# EAGLE board Pinscape Pico - Pro (SMD) Expansion Board (EAGLE 7.7.0), part 1 of 2
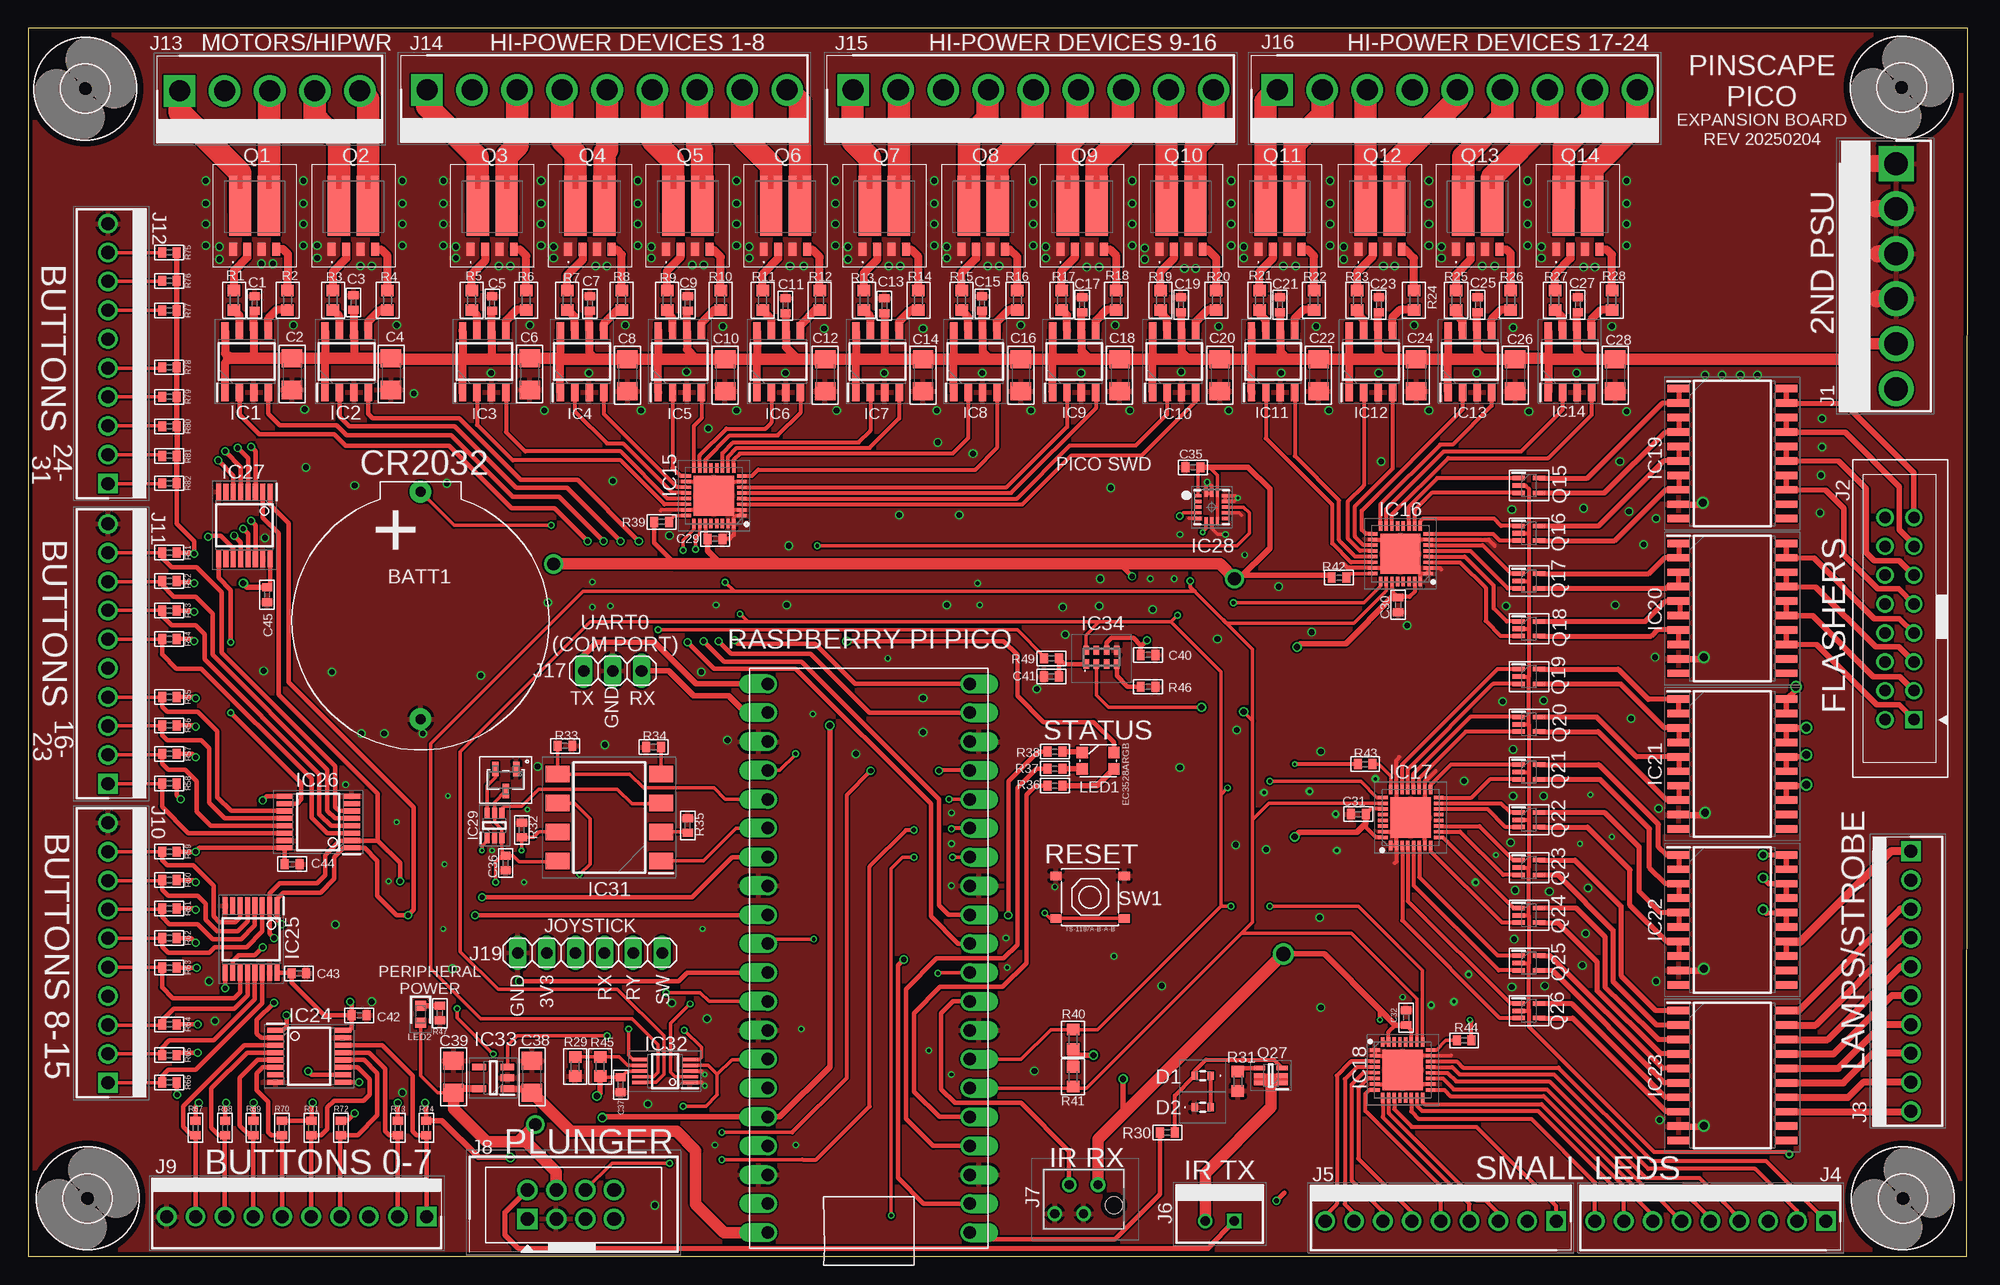
[diagram p12: board, top side]
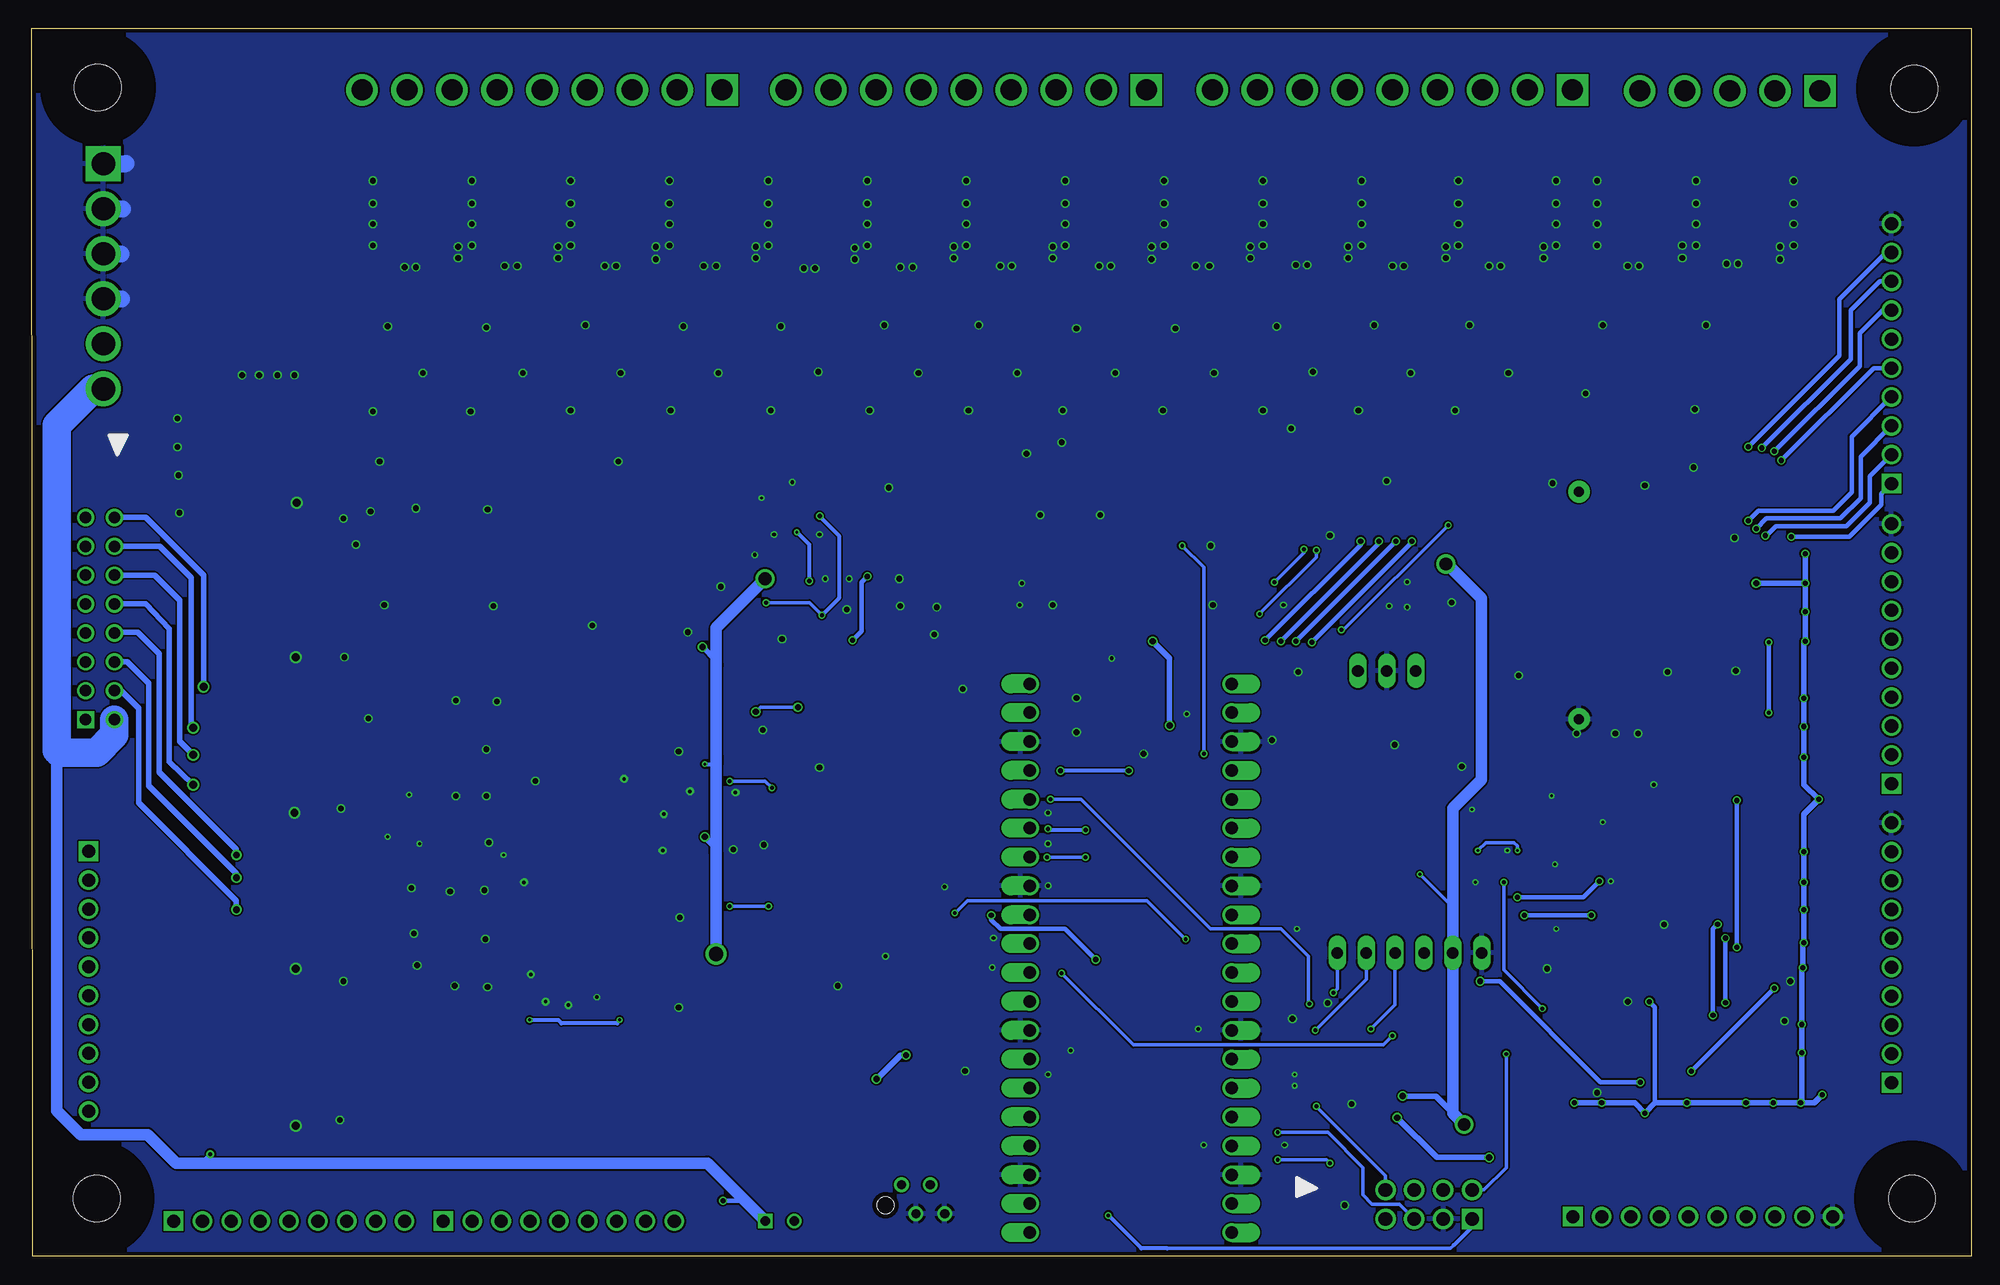
[diagram p13: board, bottom side, seen from below]

Size 170.6 x 108 mm. Coordinates in mm from the lower left corner, seen from the top.
Outline: 0,0 170.5,0 170.6,108 0,108 0,0
Copper layers (1*16): Top 0.035559375mm / dielectric 1.6mm / Bottom 0.035559375mm
Design rules "oshpark-2layer": minimum track width 6mil, minimum drill 10mil, track to track 6mil, track to pad 6mil, pad to pad 6mil, via to via 6mil, smd to smd 6mil, copper to edge 15mil, drill to drill 6mil, minimum pad ring 5mil, minimum via ring 5mil, stop-mask expansion 2.5mil, vias tented up to drill 0mil, thermal gap 10mil
Net classes: 4 5V & GND: width 0.457 mm

## Footprints (pad centres in the part's own frame; a part is rotated, then mirrored left to right if it is on the bottom)
BH-123A-1 = drill 0.9 pad 1.9: + 11.45,0; - -8.55,0
C0402 = smd 0.7 x 0.9: 1 -0.65,0; 2 0.65,0
C1206 = smd 1.6 x 1.8: 1 -1.4,0; 2 1.4,0
1N4148WT7 = smd 0.6 x 0.7: 1 -0.7,0; 2 0.7,0
SOIC127P600X175-8N = smd 1.525 x 0.65: 1 -2.712,1.905; 2 -2.712,0.635; 3 -2.712,-0.635; 4 -2.712,-1.905; 5 2.712,-1.905; 6 2.712,-0.635; 7 2.712,0.635; 8 2.712,1.905
QFN50P500X500X100-33N = smd 0.85 x 0.3: 1 -2.45,1.75; 2 -2.45,1.25; 3 -2.45,0.75; 4 -2.45,0.25; 5 -2.45,-0.25; 6 -2.45,-0.75; 7 -2.45,-1.25; 8 -2.45,-1.75; 17 2.45,-1.75; 18 2.45,-1.25; 19 2.45,-0.75; 20 2.45,-0.25; 21 2.45,0.25; 22 2.45,0.75; 23 2.45,1.25; 24 2.45,1.75 | smd 0.3 x 0.85: 9 -1.75,-2.45; 10 -1.25,-2.45; 11 -0.75,-2.45; 12 -0.25,-2.45; 13 0.25,-2.45; 14 0.75,-2.45; 15 1.25,-2.45; 16 1.75,-2.45; 25 1.75,2.45; 26 1.25,2.45; 27 0.75,2.45; 28 0.25,2.45; 29 -0.25,2.45; 30 -0.75,2.45; 31 -1.25,2.45; 32 -1.75,2.45 | smd 3.55 x 3.55: 33 0,0
SOIC127P1030X265-20N = smd 1.95 x 0.65: 1 -4.725,5.715; 2 -4.725,4.445; 3 -4.725,3.175; 4 -4.725,1.905; 5 -4.725,0.635; 6 -4.725,-0.635; 7 -4.725,-1.905; 8 -4.725,-3.175; 9 -4.725,-4.445; 10 -4.725,-5.715; 11 4.725,-5.715; 12 4.725,-4.445; 13 4.725,-3.175; 14 4.725,-1.905; 15 4.725,-0.635; 16 4.725,0.635; 17 4.725,1.905; 18 4.725,3.175; 19 4.725,4.445; 20 4.725,5.715
SOP65P640X120-16N = smd 1.475 x 0.45: 1 -2.938,2.275; 2 -2.938,1.625; 3 -2.938,0.975; 4 -2.938,0.325; 5 -2.938,-0.325; 6 -2.938,-0.975; 7 -2.938,-1.625; 8 -2.938,-2.275; 9 2.938,-2.275; 10 2.938,-1.625; 11 2.938,-0.975; 12 2.938,-0.325; 13 2.938,0.325; 14 2.938,0.975; 15 2.938,1.625; 16 2.938,2.275
LIS3DHTR = smd 0.6 x 0.3: 1 -1.2,1; 2 -1.2,0.5; 3 -1.2,0; 4 -1.2,-0.5; 5 -1.2,-1; 9 1.2,-1; 10 1.2,-0.5; 11 1.2,0; 12 1.2,0.5; 13 1.2,1 | smd 0.3 x 0.6: 6 -0.5,-1.2; 7 0,-1.2; 8 0.5,-1.2; 14 0.5,1.2; 15 0,1.2; 16 -0.5,1.2
SOP65P210X110-6N = smd 0.95 x 0.45: 1 -1.1,0.65; 2 -1.1,0; 3 -1.1,-0.65; 4 1.1,-0.65; 5 1.1,0; 6 1.1,0.65
SOT23_DIO = smd 0.559 x 1.27: 1 -0.915,-0.965; 2 0.915,-0.965; 3 0,0.965
SOP254P1016X460-8N = smd 2.1 x 1.45: 1 -4.55,3.81; 2 -4.55,1.27; 3 -4.55,-1.27; 4 -4.55,-3.81; 5 4.55,-3.81; 6 4.55,-1.27; 7 4.55,1.27; 8 4.55,3.81
SOP50P490X110-10N = smd 1.4 x 0.3: 1 -2.2,1; 2 -2.2,0.5; 3 -2.2,0; 4 -2.2,-0.5; 5 -2.2,-1; 6 2.2,-1; 7 2.2,-0.5; 8 2.2,0; 9 2.2,0.5; 10 2.2,1
SOT95P280X145-5N = smd 1.2 x 0.6: 1 -1.25,0.95; 2 -1.25,0; 3 -1.25,-0.95; 4 1.25,-0.95; 5 1.25,0.95
RV3032C7 = smd 0.5 x 0.8: 1 -1.35,-0.6; 2 -0.45,-0.6; 3 0.45,-0.6; 4 1.35,-0.6; 5 1.35,0.6; 6 0.45,0.6; 7 -0.45,0.6; 8 -1.35,0.6
SHDR6W183P0X396_1X6_2377X762X1 = drill 2.05 pad 3.075 square: 1 0,0 | drill 2.05 pad 3.075: 2 3.96,0; 3 7.92,0; 4 11.88,0; 5 15.84,0; 6 19.8,0
3M-30316-6002HB = drill 1.01 pad 1.51 square: 1 -8.89,-1.27 | drill 1.01 pad 1.51: 2 -8.89,1.27; 3 -6.35,-1.27; 4 -6.35,1.27; 5 -3.81,-1.27; 6 -3.81,1.27; 7 -1.27,-1.27; 8 -1.27,1.27; 9 1.27,-1.27; 10 1.27,1.27; 11 3.81,-1.27; 12 3.81,1.27; 13 6.35,-1.27; 14 6.35,1.27; 15 8.89,-1.27; 16 8.89,1.27
SHDR10W66P0X254_1X10_2540X572X = drill 1.15 pad 1.725 square: 1 11.43,0 | drill 1.15 pad 1.725: 2 8.89,0; 3 6.35,0; 4 3.81,0; 5 1.27,0; 6 -1.27,0; 7 -3.81,0; 8 -6.35,0; 9 -8.89,0; 10 -11.43,0
SHDR9W66P0X254_1X9_2286X572X10 = drill 1.15 pad 1.725 square: 1 10.16,0 | drill 1.15 pad 1.725: 2 7.62,0; 3 5.08,0; 4 2.54,0; 5 0,0; 6 -2.54,0; 7 -5.08,0; 8 -7.62,0; 9 -10.16,0
HDRV2W66P0X254_1X2_762X572X100 = drill 0.85 pad 1.275 square: 1 1.27,0 | drill 0.85 pad 1.275: 2 -1.27,0
2150794 = drill 0.8 pad 1.3: 1 0,0; 2 -1.27,-2.54; 3 -2.54,0; 4 -3.81,-2.54 | hole 1.5: 1.4,-1.8
SHDR8W69P254_2X4_1780X878X955P = drill 1.2 pad 1.8 square: 1 0,0 | drill 1.2 pad 1.8: 2 0,2.54; 3 2.54,0; 4 2.54,2.54; 5 5.08,0; 6 5.08,2.54; 7 7.62,0; 8 7.62,2.54
HDRV5W117P0X396_1X5_1981X762X1 = drill 1.85 pad 2.775 square: 1 7.92,0 | drill 1.85 pad 2.775: 2 3.958,0; 3 -0.004,0; 4 -3.966,0; 5 -7.928,0
SHDR9W117P0X396_1X9_3566X762X1 = drill 1.85 pad 2.775 square: 1 15.84,0 | drill 1.85 pad 2.775: 2 11.878,0; 3 7.916,0; 4 3.954,0; 5 -0.008,0; 6 -3.97,0; 7 -7.932,0; 8 -11.894,0; 9 -15.856,0
1X03 = drill 1.016 long: 1 -2.54,0; 2 0,0; 3 2.54,0
1X06 = drill 1.016 long: 1 -6.35,0; 2 -3.81,0; 3 -1.27,0; 4 1.27,0; 5 3.81,0; 6 6.35,0
EC3528ARGB = smd 1 x 1: 1 -0.725,1.4; 2 0.725,1.4; 3 -0.725,-1.4; 4 0.725,-1.4
LEDC1608X40N = smd 0.9 x 0.95: 1 -0.75,0; 2 0.75,0
RPI_PICO_TH_NO_DEBUG = drill 1.1 pad 1.6 offset: 3V3 8.89,13.97; 3V3_EN 8.89,16.51; ADC_VREF 8.89,11.43; AGND 8.89,6.35; GND@1 -8.89,19.05; GND@2 -8.89,6.35; GND@3 -8.89,-6.35; GND@4 -8.89,-19.05; GND@6 8.89,-19.05; GND@7 8.89,-6.35; GND@8 8.89,19.05; GP0 -8.89,24.13; GP1 -8.89,21.59; GP2 -8.89,16.51; GP3 -8.89,13.97; GP4 -8.89,11.43; GP5 -8.89,8.89; GP6 -8.89,3.81; GP7 -8.89,1.27; GP8 -8.89,-1.27; GP9 -8.89,-3.81; GP10 -8.89,-8.89; GP11 -8.89,-11.43; GP12 -8.89,-13.97; GP13 -8.89,-16.51; GP14 -8.89,-21.59; GP15 -8.89,-24.13; GP16 8.89,-24.13; GP17 8.89,-21.59; GP18 8.89,-16.51; GP19 8.89,-13.97; GP20 8.89,-11.43; GP21 8.89,-8.89; GP22 8.89,-3.81; GP26_A0 8.89,1.27; GP27_A1 8.89,3.81; GP28_A2 8.89,8.89; RUN 8.89,-1.27; VBUS 8.89,24.13; VSYS 8.89,21.59
BUK7K89100EX = smd 0.7 x 1.15: 1 -1.905,-3.025; 2 -0.635,-3.025; 3 0.635,-3.025; 4 1.905,-3.025 | smd 0.7 x 1.2: 5 1.905,2.849; 6 0.635,2.849; 7 -0.635,2.849; 8 -1.905,2.849 | smd 1.97 x 4.1: 9 -1.27,0.199; 10 1.27,0.199
SOT65P210X100-5N = smd 1.1 x 0.4: 1 -0.9,0.65; 2 -0.9,0; 3 -0.9,-0.65; 4 0.9,-0.65; 5 0.9,0.65
SOT65P210X110-6N = smd 1 x 0.4: 1 -1,0.65; 2 -1,0; 3 -1,-0.65; 4 1,-0.65; 5 1,0; 6 1,0.65
R0603 = smd 1 x 1.1: 1 -0.85,0; 2 0.85,0
R0402 = smd 0.7 x 0.9: 1 -0.65,0; 2 0.65,0
TS-1187A-B-A-B = smd 1 x 0.75: A -3,1.875; B 3,1.875; C -3,-1.875; D 3,-1.875
4,1 = hole 4.1: 0,0

## Placement (x,y rotation side)
BATT1  BH-123A-1  [BH-123A-1]  34.5,55.8 90 top
C1  0.1uF  [C0402]  19.9,83.8 90 top
C2  4.7uF  [C1206]  23.2,77.6 270 top
C3  0.1uF  [C0402]  28.6,83.9 90 top
C4  4.7uF  [C1206]  31.9,77.6 270 top
C5  0.1uF  [C0402]  40.8,83.8 90 top
C6  4.7uF  [C1206]  44.1,77.6 270 top
C7  0.1uF  [C0402]  49.4,83.8 90 top
C8  4.7uF  [C1206]  52.7,77.5 270 top
C9  0.1uF  [C0402]  58,83.8 90 top
C10  4.7uF  [C1206]  61.3,77.5 270 top
C11  0.1uF  [C0402]  66.6,83.6 90 top
C12  4.7uF  [C1206]  70.1,77.5 270 top
C13  0.1uF  [C0402]  75.3,83.6 90 top
C14  4.7uF  [C1206]  78.7,77.5 270 top
C15  0.1uF  [C0402]  83.9,83.8 90 top
C16  4.7uF  [C1206]  87.3,77.5 270 top
C17  0.1uF  [C0402]  92.7,83.7 90 top
C18  4.7uF  [C1206]  96,77.5 270 top
C19  0.1uF  [C0402]  101.4,83.7 90 top
C20  4.7uF  [C1206]  104.8,77.5 270 top
C21  0.1uF  [C0402]  110.1,83.7 90 top
C22  4.7uF  [C1206]  113.5,77.5 270 top
C23  0.1uF  [C0402]  118.8,83.7 90 top
C24  4.7uF  [C1206]  122.1,77.5 270 top
C25  0.1uF  [C0402]  127.5,83.7 90 top
C26  4.7uF  [C1206]  130.8,77.5 270 top
C27  0.1uF  [C0402]  136.3,83.7 90 top
C28  4.7uF  [C1206]  139.6,77.5 270 top
C29  1uF  [C0402]  60.4,63.1 0 top
C30  1uF  [C0402]  120.5,57.3 270 top
C31  1uF  [C0402]  117,38.9 180 top
C32  1uF  [C0402]  121.2,21 90 top
C35  0.1uF  [C0402]  102.45,69.4 180 top
C36  0.1uF  [C0402]  41.98,34.6 270 top
C37  0.1uF  [C0402]  52.1,15.1 270 top
C38  1uF X7R  [C1206]  44.3,15.8 90 top
C39  1uF X7R  [C1206]  37.4,15.8 90 top
C40  100nF  [C0402]  98.5,52.9 0 top
C41  100nF  [C0402]  90,51 180 top
C42  0.1uF  [C0402]  29.1,21.2 0 top
C43  0.1uF  [C0402]  23.8,24.9 0 top
C44  0.1uF  [C0402]  23.2,34.5 0 top
C45  0.1uF  [C0402]  21,58.2 270 top
D1  1N4148WT-7  [1N4148WT7]  103.3,15.9 180 top
D2  1N4148WT-7  [1N4148WT7]  103.3,13.1 0 top
IC1  UCC27523D  [SOIC127P600X175-8N]  19.2,78.7 90 top
IC2  UCC27523D  [SOIC127P600X175-8N]  28,78.7 90 top
IC3  UCC27523D  [SOIC127P600X175-8N]  40.1,78.7 90 top
IC4  UCC27523D  [SOIC127P600X175-8N]  48.7,78.7 90 top
IC5  UCC27523D  [SOIC127P600X175-8N]  57.3,78.7 90 top
IC6  UCC27523D  [SOIC127P600X175-8N]  66,78.7 90 top
IC7  UCC27523D  [SOIC127P600X175-8N]  74.7,78.7 90 top
IC8  UCC27523D  [SOIC127P600X175-8N]  83.3,78.7 90 top
IC9  UCC27523D  [SOIC127P600X175-8N]  92,78.7 90 top
IC10  UCC27523D  [SOIC127P600X175-8N]  100.8,78.7 90 top
IC11  UCC27523D  [SOIC127P600X175-8N]  109.5,78.7 90 top
IC12  UCC27523D  [SOIC127P600X175-8N]  118.1,78.7 90 top
IC13  UCC27523D  [SOIC127P600X175-8N]  126.8,78.7 90 top
IC14  UCC27523D  [SOIC127P600X175-8N]  135.6,78.7 90 top
IC15  TLC59116FIRHBR  [QFN50P500X500X100-33N]  60.3,66.9 180 top
IC16  TLC59116FIRHBR  [QFN50P500X500X100-33N]  120.7,61.8 180 top
IC17  TLC59116FIRHBR  [QFN50P500X500X100-33N]  121.6,38.6 90 top
IC18  TLC59116FIRHBR  [QFN50P500X500X100-33N]  120.9,16.4 0 top
IC19  ULN2803CDWR  [SOIC127P1030X265-20N]  149.9,70.6 0 top
IC20  ULN2803CDWR  [SOIC127P1030X265-20N]  149.9,57 0 top
IC21  ULN2803CDWR  [SOIC127P1030X265-20N]  149.9,43.3 0 top
IC22  ULN2803CDWR  [SOIC127P1030X265-20N]  149.9,29.6 0 top
IC23  ULN2803CDWR  [SOIC127P1030X265-20N]  149.9,15.9 0 top
IC24  SN74HC165PWR  [SOP65P640X120-16N]  24.7,17.6 0 top
IC25  SN74HC165PWR  [SOP65P640X120-16N]  19.6,27.9 270 top
IC26  SN74HC165PWR  [SOP65P640X120-16N]  25.5,38.2 180 top
IC27  SN74HC165PWR  [SOP65P640X120-16N]  19,64.3 270 top
IC28  LIS3DHTR  [LIS3DHTR]  104.1,65.9 0 top
IC29  SN74LVC1G175DCKR  [SOP65P210X110-6N]  41,37.9 90 top
IC30  APX809S-29SA-7  [SOT23_DIO]  42,41.9 180 top
IC31  LTV-827S  [SOP254P1016X460-8N]  51.1,38.6 180 top
IC32  ADS1115IDGSR  [SOP50P490X110-10N]  56,16.3 180 top
IC33  TLV75733PDBVR  [SOT95P280X145-5N]  40.9,15.7 180 top
IC34  RV-3032-C7  [RV3032C7]  94.4,52.7 0 top
J1  640445-6  [SHDR6W183P0X396_1X6_2377X762X1]  164.3,96.1 270 top
J2  30316-6002HB  [3M-30316-6002HB]  164.6,56.1 90 top
J3  1-640456-0  [SHDR10W66P0X254_1X10_2540X572X]  165.6,24.2 90 top
J4  640456-9  [SHDR9W66P0X254_1X9_2286X572X10]  147.97,3.1 0 top
J5  640456-9  [SHDR9W66P0X254_1X9_2286X572X10]  124.24,3.1 0 top
J6  640454-2  [HDRV2W66P0X254_1X2_762X572X100]  104.8,3.1 0 top
J7  215079-4  [2150794]  94.1,6.3 0 top
J8  30308-6002HB  [SHDR8W69P254_2X4_1780X878X955P]  43.9,3.3 0 top
J9  1-640456-0  [SHDR10W66P0X254_1X10_2540X572X]  23.6,3.5 0 top
J10  1-640456-0  [SHDR10W66P0X254_1X10_2540X572X]  7,26.7 270 top
J11  1-640456-0  [SHDR10W66P0X254_1X10_2540X572X]  7,53 270 top
J12  1-640456-0  [SHDR10W66P0X254_1X10_2540X572X]  7,79.4 270 top
J13  640445-5  [HDRV5W117P0X396_1X5_1981X762X1]  21.22,102.5 180 top
J14  640445-9  [SHDR9W117P0X396_1X9_3566X762X1]  50.9,102.6 180 top
J15  640445-9  [SHDR9W117P0X396_1X9_3566X762X1]  88.4,102.6 180 top
J16  640445-9  [SHDR9W117P0X396_1X9_3566X762X1]  125.7,102.6 180 top
J17  [1X03]  51.4,51.5 0 top
J19  [1X06]  49.4,26.7 180 top
LED1  EC3528ARGB  [EC3528ARGB]  94.1,43.6 270 top
LED2  LT_Q39G-Q1OO-25-1  [LEDC1608X40N]  34.5,21.3 270 top
PICO1  PICO  [RPI_PICO_TH_NO_DEBUG]  73.93,26.23 180 top
Q1  BUK7K89-100EX  [BUK7K89100EX]  19.9,91.6 0 top
Q2  BUK7K89-100EX  [BUK7K89100EX]  28.6,91.6 0 top
Q3  BUK7K89-100EX  [BUK7K89100EX]  40.8,91.6 0 top
Q4  BUK7K89-100EX  [BUK7K89100EX]  49.4,91.6 0 top
Q5  BUK7K89-100EX  [BUK7K89100EX]  58,91.6 0 top
Q6  BUK7K89-100EX  [BUK7K89100EX]  66.6,91.6 0 top
Q7  BUK7K89-100EX  [BUK7K89100EX]  75.3,91.6 0 top
Q8  BUK7K89-100EX  [BUK7K89100EX]  84,91.6 0 top
Q9  BUK7K89-100EX  [BUK7K89100EX]  92.7,91.6 0 top
Q10  BUK7K89-100EX  [BUK7K89100EX]  101.4,91.6 0 top
Q11  BUK7K89-100EX  [BUK7K89100EX]  110.1,91.6 0 top
Q12  BUK7K89-100EX  [BUK7K89100EX]  118.9,91.6 0 top
Q13  BUK7K89-100EX  [BUK7K89100EX]  127.5,91.6 0 top
Q14  BUK7K89-100EX  [BUK7K89100EX]  136.3,91.6 0 top
Q15  UMA5NTR  [SOT65P210X100-5N]  132,67.8 0 top
Q16  UMA5NTR  [SOT65P210X100-5N]  132,63.6 0 top
Q17  UMA5NTR  [SOT65P210X100-5N]  132,59.4 0 top
Q18  UMA5NTR  [SOT65P210X100-5N]  132,55.2 0 top
Q19  UMA5NTR  [SOT65P210X100-5N]  132,51 0 top
Q20  UMA5NTR  [SOT65P210X100-5N]  132,46.8 0 top
Q21  UMA5NTR  [SOT65P210X100-5N]  132,42.6 0 top
Q22  UMA5NTR  [SOT65P210X100-5N]  132,38.4 0 top
Q23  UMA5NTR  [SOT65P210X100-5N]  132,34.2 0 top
Q24  UMA5NTR  [SOT65P210X100-5N]  132,30 0 top
Q25  UMA5NTR  [SOT65P210X100-5N]  132,25.8 0 top
Q26  UMA5NTR  [SOT65P210X100-5N]  132,21.6 0 top
Q27  DSS8110Y-7  [SOT65P210X110-6N]  109.3,15.9 180 top
R1  4R7  [R0603]  18.1,84.1 270 top
R2  4R7  [R0603]  22.8,84.1 270 top
R3  4R7  [R0603]  26.8,84.1 270 top
R4  4R7  [R0603]  31.6,84.1 270 top
R5  200R  [R0603]  39,84.1 270 top
R6  200R  [R0603]  43.8,84.1 270 top
R7  200R  [R0603]  47.4,84.1 270 top
R8  200R  [R0603]  52.2,84.1 270 top
R9  200R  [R0603]  56.2,84.1 270 top
R10  200R  [R0603]  60.9,84.1 270 top
R11  200R  [R0603]  64.6,84.1 270 top
R12  200R  [R0603]  69.6,84.1 270 top
R13  200R  [R0603]  73.5,84.1 270 top
R14  200R  [R0603]  78.3,84.1 270 top
R15  200R  [R0603]  82.1,84.1 270 top
R16  200R  [R0603]  87,84.1 270 top
R17  200R  [R0603]  90.9,84.1 270 top
R18  200R  [R0603]  95.7,84.1 270 top
R19  200R  [R0603]  99.6,84.1 270 top
R20  200R  [R0603]  104.5,84.1 270 top
R21  200R  [R0603]  108.3,84.1 270 top
R22  200R  [R0603]  113.1,84.1 270 top
R23  200R  [R0603]  116.9,84.1 270 top
R24  200R  [R0603]  121.9,84.1 270 top
R25  200R  [R0603]  125.6,84.1 270 top
R26  200R  [R0603]  130.4,84.1 270 top
R27  200R  [R0603]  134.3,84.1 270 top
R28  200R  [R0603]  139.3,84.1 270 top
R29  10K  [R0603]  48.1,16.7 90 top
R30  540R  [R0402]  100.2,10.9 180 top
R31  2R5  [R0603]  106.4,15.4 90 top
R32  10K  [R0402]  43.4,37.5 270 top
R33  10K  [R0402]  47.2,44.9 180 top
R34  360R  [R0402]  55,44.8 180 top
R35  240R  [R0402]  58,37.9 90 top
R36  100R  [R0402]  90.3,41.4 0 top
R37  100R  [R0402]  90.3,42.9 0 top
R38  300R  [R0402]  90.3,44.4 0 top
R39  10K  [R0402]  55.7,64.6 180 top
R40  3.9K  [R0603]  91.9,19.1 270 top
R41  3.9K  [R0603]  91.9,15.8 90 top
R42  10K  [R0402]  115.3,59.7 180 top
R43  10K  [R0402]  117.6,43.3 180 top
R44  10K  [R0402]  126.3,19 0 top
R45  10K  [R0603]  50.3,16.7 90 top
R46  10K  [R0402]  98.5,50.1 180 top
R47  100R  [R0402]  36.2,21.4 90 top
R49  100R  [R0402]  90,52.6 180 top
R51  10k  [R0402]  12.4,61.9 180 top
R52  10k  [R0402]  12.4,59.4 180 top
R53  10k  [R0402]  12.4,56.8 180 top
R54  10k  [R0402]  12.4,54.3 180 top
R55  10k  [R0402]  12.4,49.2 180 top
R56  10k  [R0402]  12.4,46.7 180 top
R57  10k  [R0402]  12.4,44.2 180 top
R58  10k  [R0402]  12.4,41.6 180 top
R59  10k  [R0402]  12.4,35.6 180 top
R60  10k  [R0402]  12.4,33.1 180 top
R61  10k  [R0402]  12.4,30.6 180 top
R62  10k  [R0402]  12.4,28 180 top
R63  10k  [R0402]  12.4,25.4 180 top
R64  10k  [R0402]  12.4,20.4 180 top
R65  10k  [R0402]  12.4,17.7 180 top
R66  10k  [R0402]  12.4,15.3 180 top
R67  10k  [R0402]  14.7,11.3 270 top
R68  10k  [R0402]  17.3,11.3 270 top
R69  10k  [R0402]  19.8,11.3 270 top
R70  10k  [R0402]  22.3,11.3 270 top
R71  10k  [R0402]  24.9,11.3 270 top
R72  10k  [R0402]  27.5,11.3 270 top
R73  10k  [R0402]  32.5,11.3 270 top
R74  10k  [R0402]  35,11.3 270 top
R75  10k  [R0402]  12.4,88.3 180 top
R76  10k  [R0402]  12.4,85.8 180 top
R77  10k  [R0402]  12.4,83.2 180 top
R78  10k  [R0402]  12.4,78.2 180 top
R79  10k  [R0402]  12.4,75.6 180 top
R80  10k  [R0402]  12.4,73 180 top
R81  10k  [R0402]  12.4,70.4 180 top
R82  10k  [R0402]  12.4,68 180 top
SW1  TS-1187A-B-A-B  [TS-1187A-B-A-B]  93.4,31.6 180 top
U$1  [4,1]  5,102.7 0 top
U$2  [4,1]  164.8,102.8 0 top
U$3  [4,1]  164.9,5.1 0 top
U$4  [4,1]  5.2,5.1 0 top